# EAGLE schematic design1 (EAGLE 6.5.0)
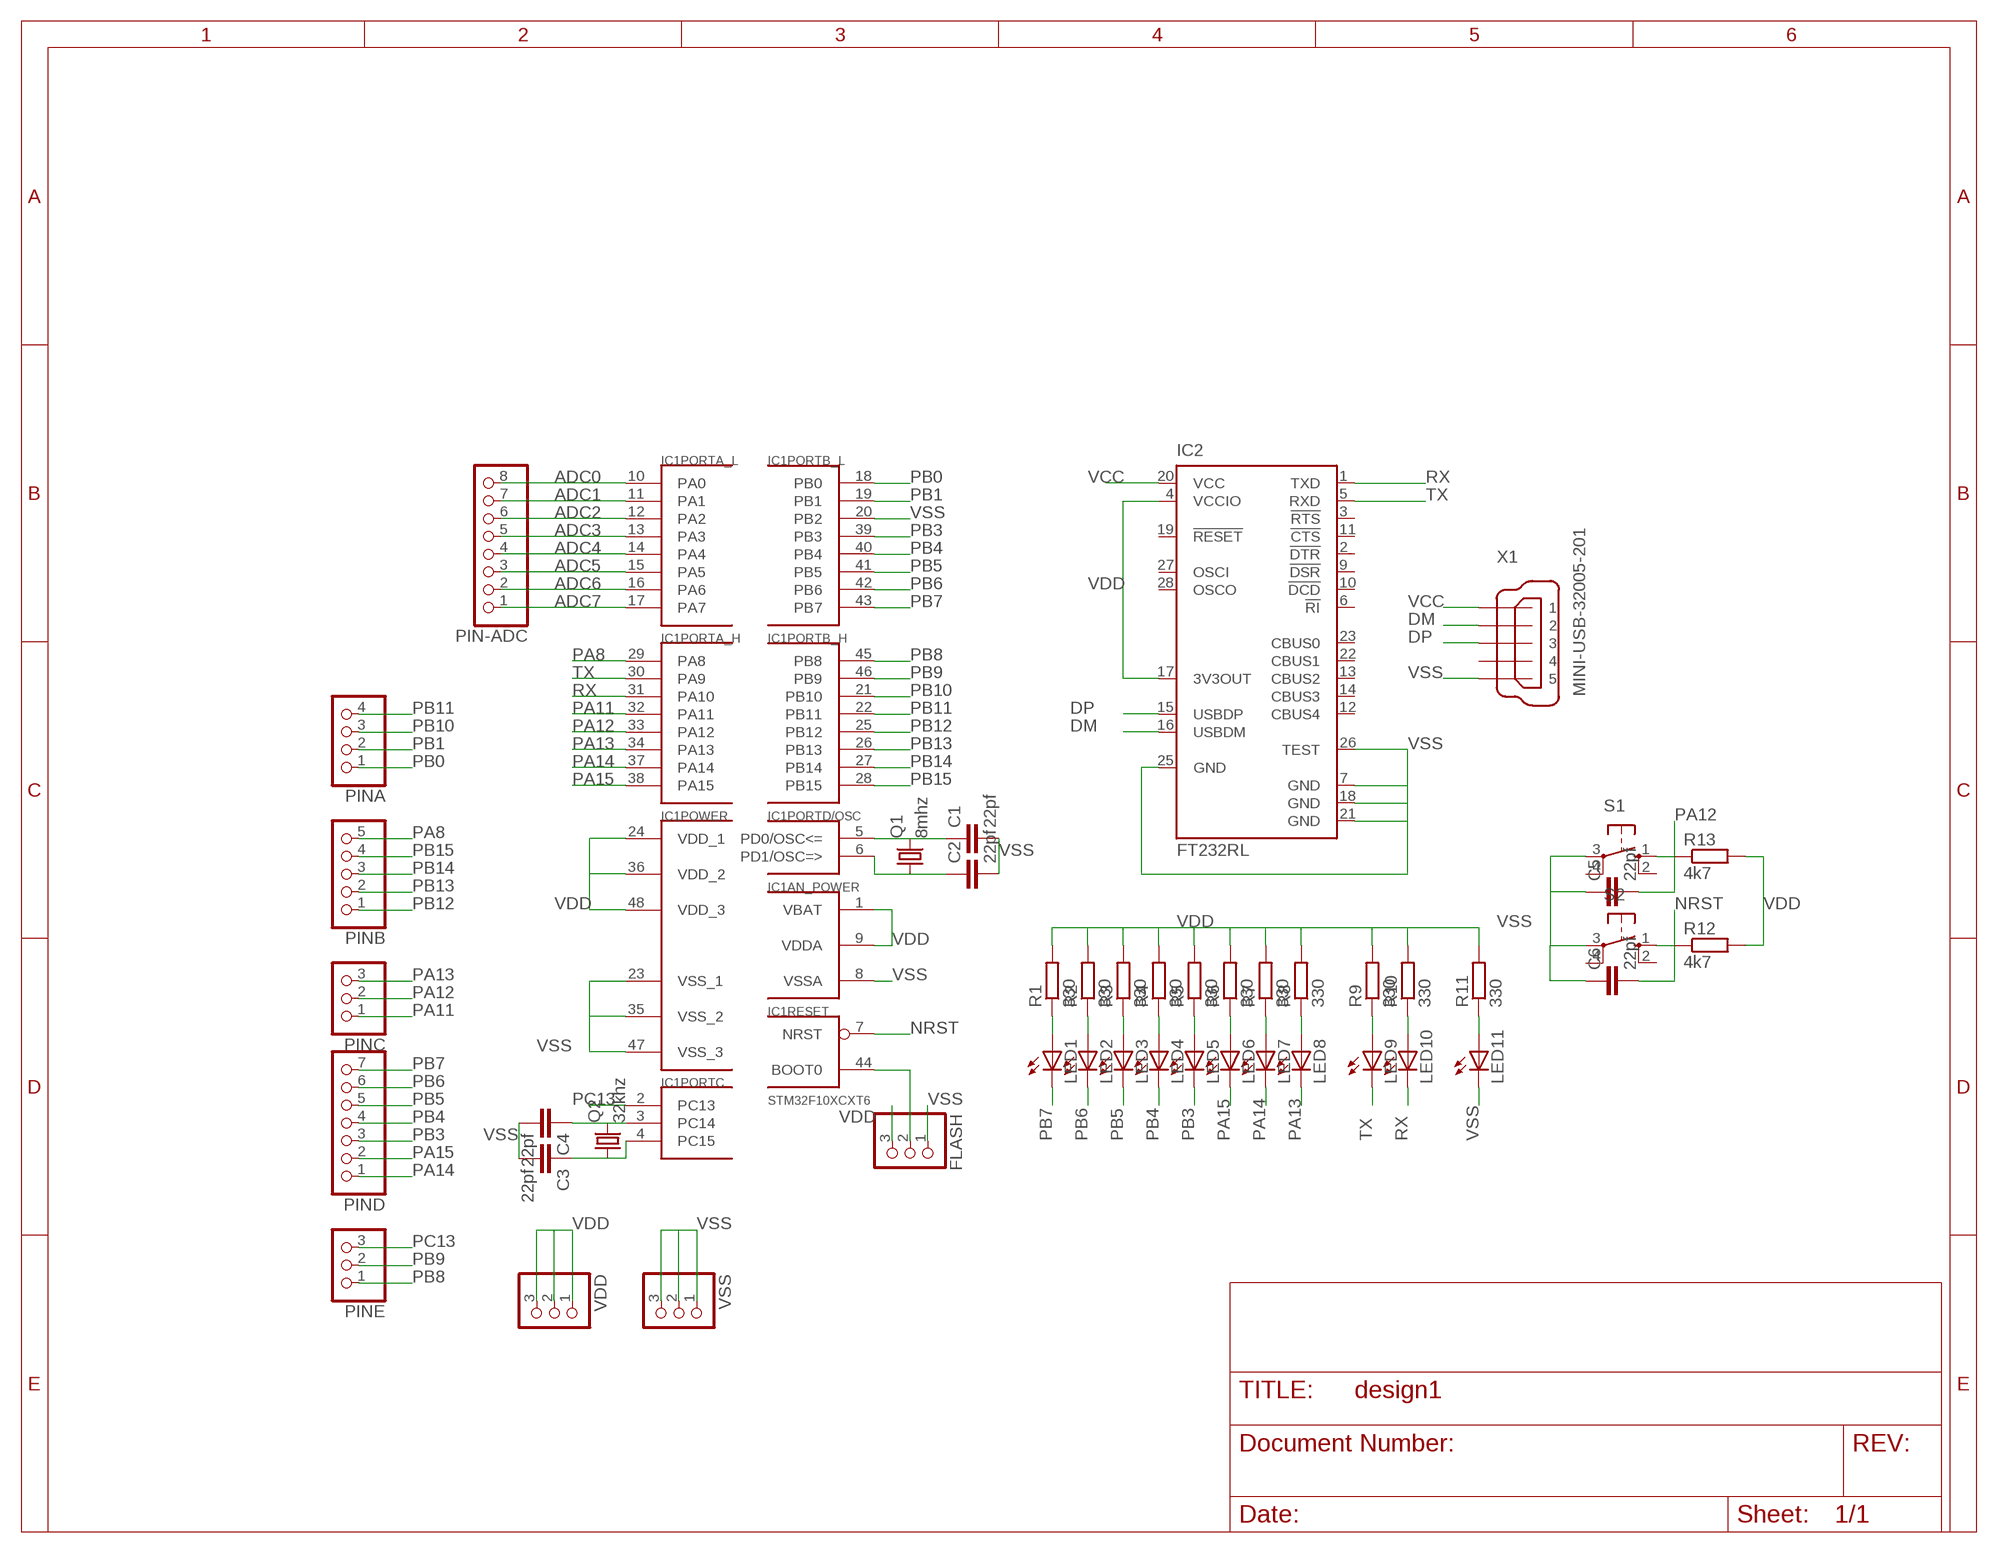
[diagram p0: schematic, sheet 1]

## Parts
C1  22pf  C-EUC1206  [C1206]
C2  22pf  C-EUC1206  [C1206]
C3  22pf  C-EUC1206  [C1206]
C4  22pf  C-EUC1206  [C1206]
C5  22pf  C-EUC1206  [C1206]
C6  22pf  C-EUC1206  [C1206]
FLASH  PINHD-1X3  [1X03]
IC1  STM32F10XCXT6  [TQFP48]
IC2  FT232RL  [SSOP28]
LED1  LEDSML1206  [SML1206]
LED2  LEDSML1206  [SML1206]
LED3  LEDSML1206  [SML1206]
LED4  LEDSML1206  [SML1206]
LED5  LEDSML1206  [SML1206]
LED6  LEDSML1206  [SML1206]
LED7  LEDSML1206  [SML1206]
LED8  LEDSML1206  [SML1206]
LED9  LEDSML1206  [SML1206]
LED10  LEDSML1206  [SML1206]
LED11  LEDSML1206  [SML1206]
PIN-ADC  PINHD-1X8  [1X08]
PINA  PINHD-1X4  [1X04]
PINB  PINHD-1X5  [1X05]
PINC  PINHD-1X3  [1X03]
PIND  PINHD-1X7  [1X07]
PINE  PINHD-1X3  [1X03]
Q1  8mhz  CRYSTALHC49U-V  [HC49U-V]
Q2  32khz  CRYSTALTC26V  [TC26V]
R1  330  R-EU_R1206  [R1206]
R2  330  R-EU_R1206  [R1206]
R3  330  R-EU_R1206  [R1206]
R4  330  R-EU_R1206  [R1206]
R5  330  R-EU_R1206  [R1206]
R6  330  R-EU_R1206  [R1206]
R7  330  R-EU_R1206  [R1206]
R8  330  R-EU_R1206  [R1206]
R9  330  R-EU_R1206  [R1206]
R10  330  R-EU_R1206  [R1206]
R11  330  R-EU_R1206  [R1206]
R12  4k7  R-EU_R1206  [R1206]
R13  4k7  R-EU_R1206  [R1206]
S1  10-XX  [B3F-10XX]
S2  10-XX  [B3F-10XX]
VDD  PINHD-1X3  [1X03]
VSS  PINHD-1X3  [1X03]
X1  MINI-USB-32005-201  [32005-201]

## Nets
ADC0: IC1.10(PORTA_L:PA0) PIN-ADC.8
ADC1: IC1.11(PORTA_L:PA1) PIN-ADC.7
ADC2: IC1.12(PORTA_L:PA2) PIN-ADC.6
ADC3: IC1.13(PORTA_L:PA3) PIN-ADC.5
ADC4: IC1.14(PORTA_L:PA4) PIN-ADC.4
ADC5: IC1.15(PORTA_L:PA5) PIN-ADC.3
ADC6: IC1.16(PORTA_L:PA6) PIN-ADC.2
ADC7: IC1.17(PORTA_L:PA7) PIN-ADC.1
DM: IC2.16(USBDM) X1.2
DP: IC2.15(USBDP) X1.3
N$9: C1.1 IC1.5(PORTD/OSC:PD0/OSC<=) Q1.2
N$10: C2.1 IC1.6(PORTD/OSC:PD1/OSC=>) Q1.1
N$11: C3.1 IC1.4(PORTC:PC15) Q2.1
N$12: C4.1 IC1.3(PORTC:PC14) Q2.2
N$13: FLASH.2 IC1.44(RESET:BOOT0)
N$14: LED1.A R1.1
N$15: LED2.A R2.1
N$16: LED3.A R3.1
N$17: LED4.A R4.1
N$18: LED5.A R5.1
N$19: LED6.A R6.1
N$20: LED7.A R7.1
N$21: LED8.A R8.1
N$22: LED9.A R9.1
N$23: LED10.A R10.1
N$24: LED11.A R11.1
NRST: C6.2 IC1.7(RESET:NRST) R12.1 S2.1(S)
PA8: IC1.29(PORTA_H:PA8) PINB.5
PA11: IC1.32(PORTA_H:PA11) PINC.1
PA12: C5.2 IC1.33(PORTA_H:PA12) PINC.2 R13.1 S1.1(S)
PA13: IC1.34(PORTA_H:PA13) LED8.C PINC.3
PA14: IC1.37(PORTA_H:PA14) LED7.C PIND.1
PA15: IC1.38(PORTA_H:PA15) LED6.C PIND.2
PB0: IC1.18(PORTB_L:PB0) PINA.1
PB1: IC1.19(PORTB_L:PB1) PINA.2
PB3: IC1.39(PORTB_L:PB3) LED5.C PIND.3
PB4: IC1.40(PORTB_L:PB4) LED4.C PIND.4
PB5: IC1.41(PORTB_L:PB5) LED3.C PIND.5
PB6: IC1.42(PORTB_L:PB6) LED2.C PIND.6
PB7: IC1.43(PORTB_L:PB7) LED1.C PIND.7
PB8: IC1.45(PORTB_H:PB8) PINE.1
PB9: IC1.46(PORTB_H:PB9) PINE.2
PB10: IC1.21(PORTB_H:PB10) PINA.3
PB11: IC1.22(PORTB_H:PB11) PINA.4
PB12: IC1.25(PORTB_H:PB12) PINB.1
PB13: IC1.26(PORTB_H:PB13) PINB.2
PB14: IC1.27(PORTB_H:PB14) PINB.3
PB15: IC1.28(PORTB_H:PB15) PINB.4
PC13: IC1.2(PORTC:PC13) PINE.3
RX: IC1.31(PORTA_H:PA10) IC2.1(TXD) LED10.C
TX: IC1.30(PORTA_H:PA9) IC2.5(RXD) LED9.C
VCC: IC2.20(VCC) X1.1
VDD: FLASH.3 IC1.1(AN_POWER:VBAT) IC1.9(AN_POWER:VDDA) IC1.24(POWER:VDD_1) IC1.36(POWER:VDD_2) IC1.48(POWER:VDD_3) IC2.4(VCCIO) IC2.17(3V3OUT) R1.2 R2.2 R3.2 R4.2 R5.2 R6.2 R7.2 R8.2 R9.2 R10.2 R11.2 R12.2 R13.2 VDD.1 VDD.2 VDD.3
VSS: C1.2 C2.2 C3.2 C4.2 C5.1 C6.1 FLASH.1 IC1.8(AN_POWER:VSSA) IC1.20(PORTB_L:PB2) IC1.23(POWER:VSS_1) IC1.35(POWER:VSS_2) IC1.47(POWER:VSS_3) IC2.7(GND) IC2.18(GND) IC2.21(GND) IC2.25(GND) IC2.26(TEST) LED11.C S1.3(P) S2.3(P) VSS.1 VSS.2 VSS.3 X1.5
Unconnected: IC2.2(!DTR) IC2.3(!RTS) IC2.6(!RI) IC2.9(!DSR) IC2.10(!DCD) IC2.11(!CTS) IC2.12(CBUS4) IC2.13(CBUS2) IC2.14(CBUS3) IC2.19(!RESET) IC2.22(CBUS1) IC2.23(CBUS0) IC2.27(OSCI) IC2.28(OSCO) S1.2(S1) S1.4(P1) S2.2(S1) S2.4(P1) X1.4

## Library data of the parts
C1-C6 = resistor:C-EU: CAPACITOR, European symbol
FLASH PINC PINE VDD VSS = pinhead:PINHD-1X3: PIN HEADER
IC1 = stm32:STM32F10XCXT6: ST STM32F101/103 48pin LQFP
IC2 = ftdichip:FT232R: Source: http://www.ftdichip.com/Documents/DataSheets/DS_FT232R_v104.pdf; MPN: FT232RL; OC_FARNELL: 1146032; OC_NEWARK: 91K9918
LED1-LED11 = led:LED: LED OSRAM: - CHIPLED LG R971, LG N971, LY N971, LG Q971, LY Q971, LO R971, LY R971 LH N974, LH R974 LS Q976, LO Q976, LY Q976 LO Q996 - Hyper CHIPLED LW Q18S LB Q993, LB Q99A, LB R99A - SideLED LS A670, LO A670, LY A670, LG A670, LP A670 LB A673, LV A673, LT A673, LW A673 LH A674 LY A675 LS A676, LA A676, LO A676, LY A676, LW A676 LS A679, LY A679, LG A679 - Hyper Micro SIDELED® LS Y876, LA Y876, LO Y876, LY Y876 LT Y87S - SmartLED LW L88C, LW L88S LB L89C, LB L89S, LG L890 LS L89K, LO L89K, LY L89K LS L896, LA L896, LO L896, LY L896 - TOPLED LS T670, LO T670, LY T670, LG T670, LP T670 LSG T670, LSP T670, LSY T670, LOP T670, LYG T670 LG T671, LOG T671, LSG T671 LB T673, LV T673, LT T673, LW T673 LH T674 LS T676, LA T676, LO T676, LY T676, LB T676, LH T676, LSB T676, LW T676 LB T67C, LV T67C, LT T67C, LS T67K, LO T67K, LY T67K, LW E67C LS E67B, LA E67B, LO E67B, LY E67B, LB E67C, LV E67C, LT E67C LW T67C LS T679, LY T679, LG T679 LS T770, LO T770, LY T770, LG T770, LP T770 LB T773, LV T773, LT T773, LW T773 LH T774 LS E675, LA E675, LY E675, LS T675 LS T776, LA T776, LO T776, LY T776, LB T776 LHGB T686 LT T68C, LB T68C - Hyper Mini TOPLED® LB M676 - Mini TOPLED Santana® LG M470 LS M47K, LO M47K, LY M47K Source: http://www.osram.convergy.de LUXEON: - LUMILED® LXK2-PW12-R00, LXK2-PW12-S00, LXK2-PW14-U00, LXK2-PW14-V00 LXK2-PM12-R00, LXK2-PM12-S00, LXK2-PM14-U00 LXK2-PE12-Q00, LXK2-PE12-R00, LXK2-PE12-S00, LXK2-PE14-T00, LXK2-PE14-U00 LXK2-PB12-K00, LXK2-PB12-L00, LXK2-PB12-M00, LXK2-PB14-N00, LXK2-PB14-P00, LXK2-PB14-Q00 LXK2-PR12-L00, LXK2-PR12-M00, LXK2-PR14-Q00, LXK2-PR14-R00 LXK2-PD12-Q00, LXK2-PD12-R00, LXK2-PD12-S00 LXK2-PH12-R00, LXK2-PH12-S00 LXK2-PL12-P00, LXK2-PL12-Q00, LXK2-PL12-R00 Source: www.luxeon.com KINGBRIGHT: KA-3528ASYC Source: www.kingbright.com
PIN-ADC = pinhead:PINHD-1X8: PIN HEADER
PINA = pinhead:PINHD-1X4: PIN HEADER
PINB = pinhead:PINHD-1X5: PIN HEADER
PIND = pinhead:PINHD-1X7: PIN HEADER
Q1 = crystal:CRYSTAL: CRYSTAL; OC_FARNELL: 1666969; OC_NEWARK: unknown
Q2 = crystal:CRYSTAL: CRYSTAL; OC_FARNELL: unknown; OC_NEWARK: unknown
R1-R13 = resistor:R-EU_: RESISTOR, European symbol
S1 S2 = switch-omron:10-XX: OMRON SWITCH; MPN: B3F-1000; OC_FARNELL: 176432; OC_NEWARK: 36M3542
X1 = con-cypressindustries:MINI-USB-: MINI USB-B Conector Source: www.cypressindustries.com; OC_FARNELL: unknown; OC_NEWARK: unknown